# EAGLE schematic rc522-nodemcu (EAGLE 9.3.2)
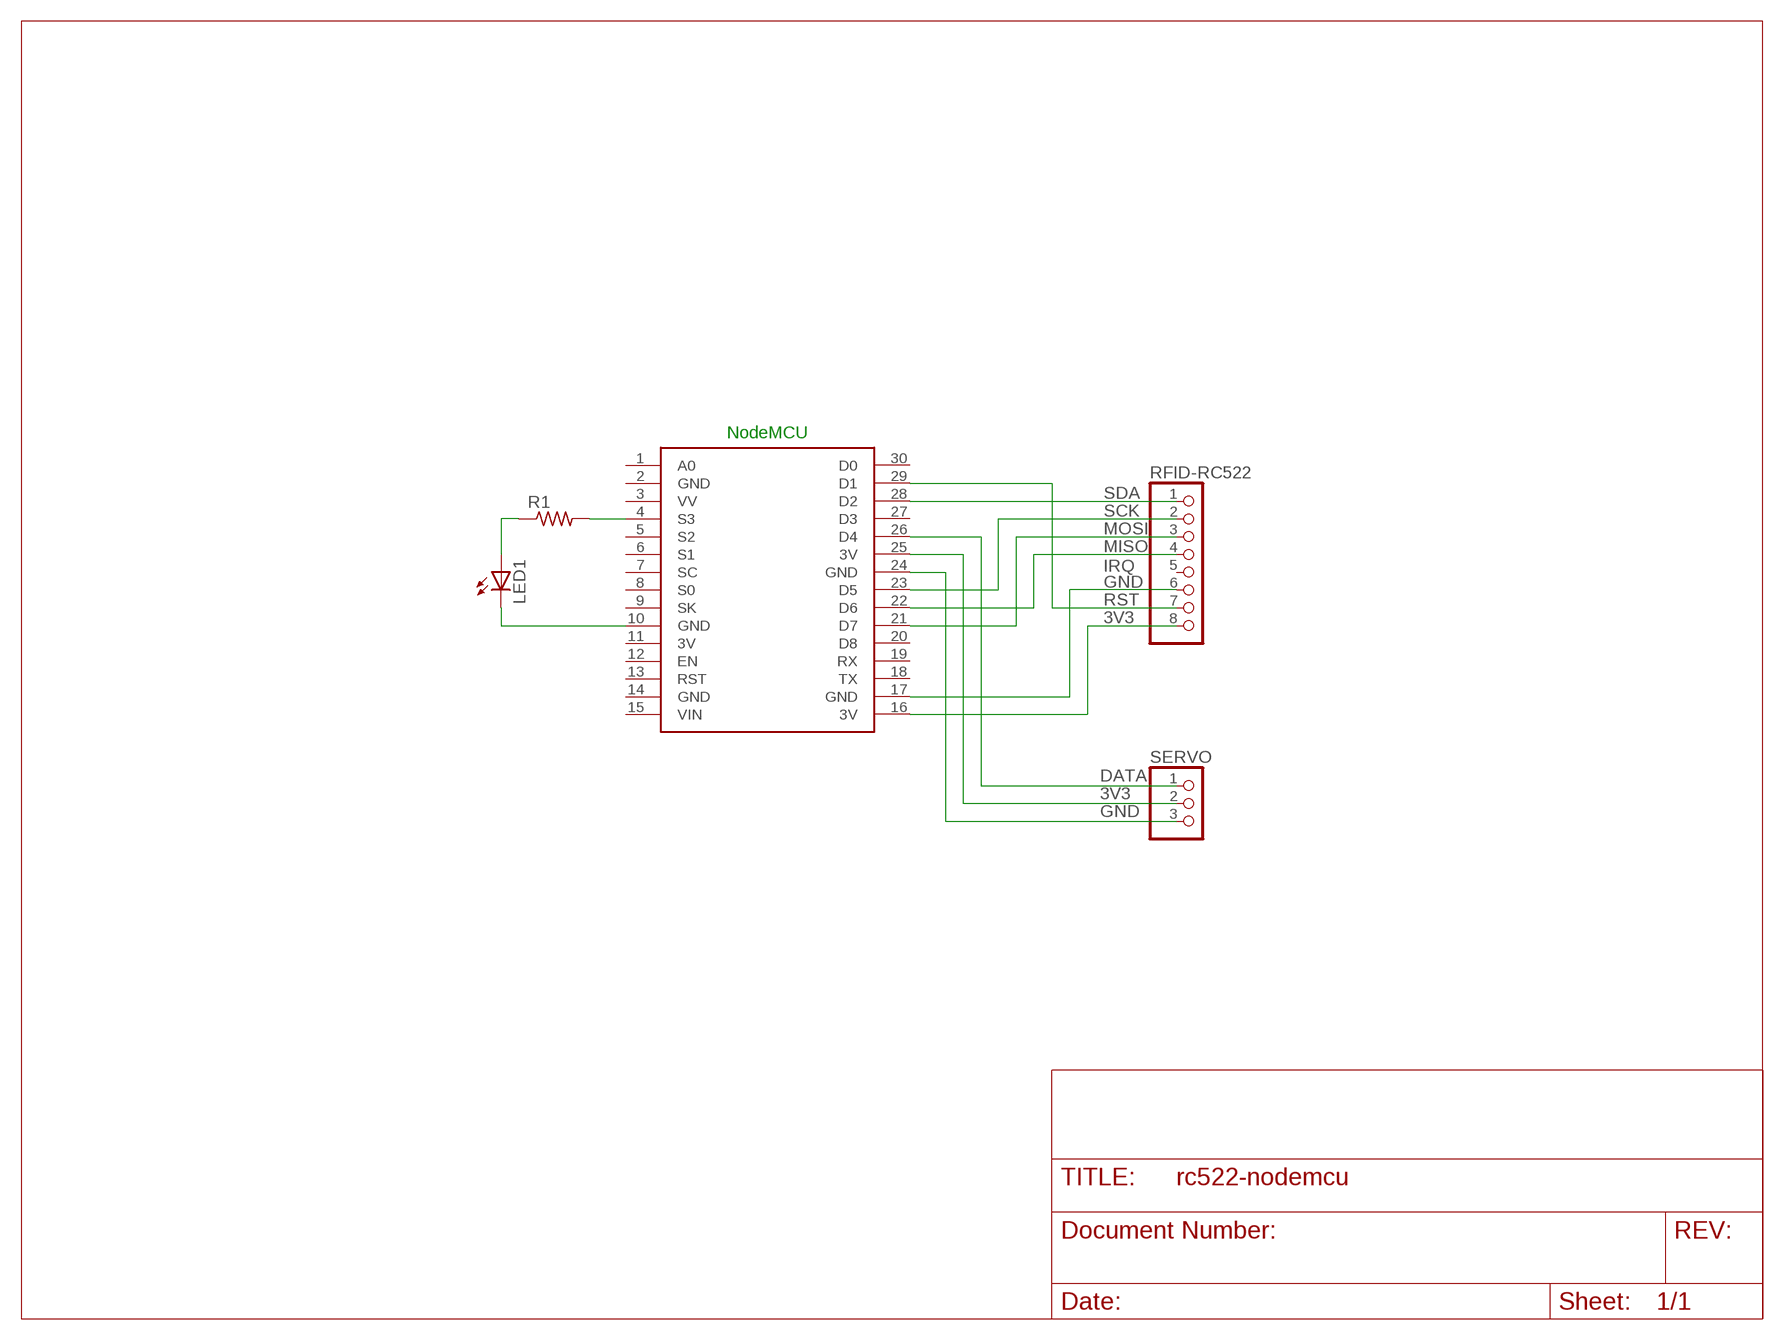
[diagram p0: schematic, sheet 1]

## Parts
LED1  LED5MM  [LED5MM]
NODEMCU  NODEMCU  [NODEMCU]
R1  R-US_0207/10  [0207/10]
RFID-RC522  PINHD-1X8-3.5MM  [1X08-3.5MM]
SERVO  PINHD-1X3  [1X03]

## Nets
3V3: NODEMCU.16(3V) NODEMCU.25(3V) RFID-RC522.8 SERVO.2
DATA: NODEMCU.26(D4) SERVO.1
GND: NODEMCU.17(GND) NODEMCU.24(GND) RFID-RC522.6 SERVO.3
MISO: NODEMCU.22(D6) RFID-RC522.4
MOSI: NODEMCU.21(D7) RFID-RC522.3
N$1: LED1.A NODEMCU.4(S3) R1.1 R1.2
N$2: LED1.K(C) NODEMCU.10(GND)
RST: NODEMCU.29(D1) RFID-RC522.7
SCK: NODEMCU.23(D5) RFID-RC522.2
SDA: NODEMCU.28(D2) RFID-RC522.1
Unconnected: NODEMCU.1(A0) NODEMCU.3(VV) NODEMCU.5(S2) NODEMCU.6(S1) NODEMCU.7(SC) NODEMCU.8(S0) NODEMCU.9(SK) NODEMCU.12(EN) NODEMCU.13(RST) NODEMCU.15(VIN) NODEMCU.18(TX) NODEMCU.19(RX) NODEMCU.20(D8) NODEMCU.27(D3) NODEMCU.30(D0) RFID-RC522.5

## Notes on the sheet
- NodeMCU
- IRQ

## Power pins joined to a net without a drawn wire
3V: NODEMCU.11(3V)
GND: NODEMCU.2(GND) NODEMCU.14(GND)

## Library data of the parts
LED1 = adafruit:LED: LED OSRAM: - CHIPLED LG R971, LG N971, LY N971, LG Q971, LY Q971, LO R971, LY R971 LH N974, LH R974 LS Q976, LO Q976, LY Q976 LO Q996 - Hyper CHIPLED LW Q18S LB Q993, LB Q99A, LB R99A - SideLED LS A670, LO A670, LY A670, LG A670, LP A670 LB A673, LV A673, LT A673, LW A673 LH A674 LY A675 LS A676, LA A676, LO A676, LY A676, LW A676 LS A679, LY A679, LG A679 - Hyper Micro SIDELED® LS Y876, LA Y876, LO Y876, LY Y876 LT Y87S - SmartLED LW L88C, LW L88S LB L89C, LB L89S, LG L890 LS L89K, LO L89K, LY L89K LS L896, LA L896, LO L896, LY L896 - TOPLED LS T670, LO T670, LY T670, LG T670, LP T670 LSG T670, LSP T670, LSY T670, LOP T670, LYG T670 LG T671, LOG T671, LSG T671 LB T673, LV T673, LT T673, LW T673 LH T674 LS T676, LA T676, LO T676, LY T676, LB T676, LH T676, LSB T676, LW T676 LB T67C, LV T67C, LT T67C, LS T67K, LO T67K, LY T67K, LW E67C LS E67B, LA E67B, LO E67B, LY E67B, LB E67C, LV E67C, LT E67C LW T67C LS T679, LY T679, LG T679 LS T770, LO T770, LY T770, LG T770, LP T770 LB T773, LV T773, LT T773, LW T773 LH T774 LS E675, LA E675, LY E675, LS T675 LS T776, LA T776, LO T776, LY T776, LB T776 LHGB T686 LT T68C, LB T68C - Hyper Mini TOPLED® LB M676 - Mini TOPLED Santana® LG M470 LS M47K, LO M47K, LY M47K Source: http://www.osram.convergy.de/
NODEMCU = nodemcu:NODEMCU
R1 = adafruit:R-US_: RESISTOR, American symbol
RFID-RC522 = adafruit:PINHD-1X8: PIN HEADER
SERVO = adafruit:PINHD-1X3: PIN HEADER